# EAGLE design sx1509-breakout_mount_remap2 (EAGLE 9.1.3)
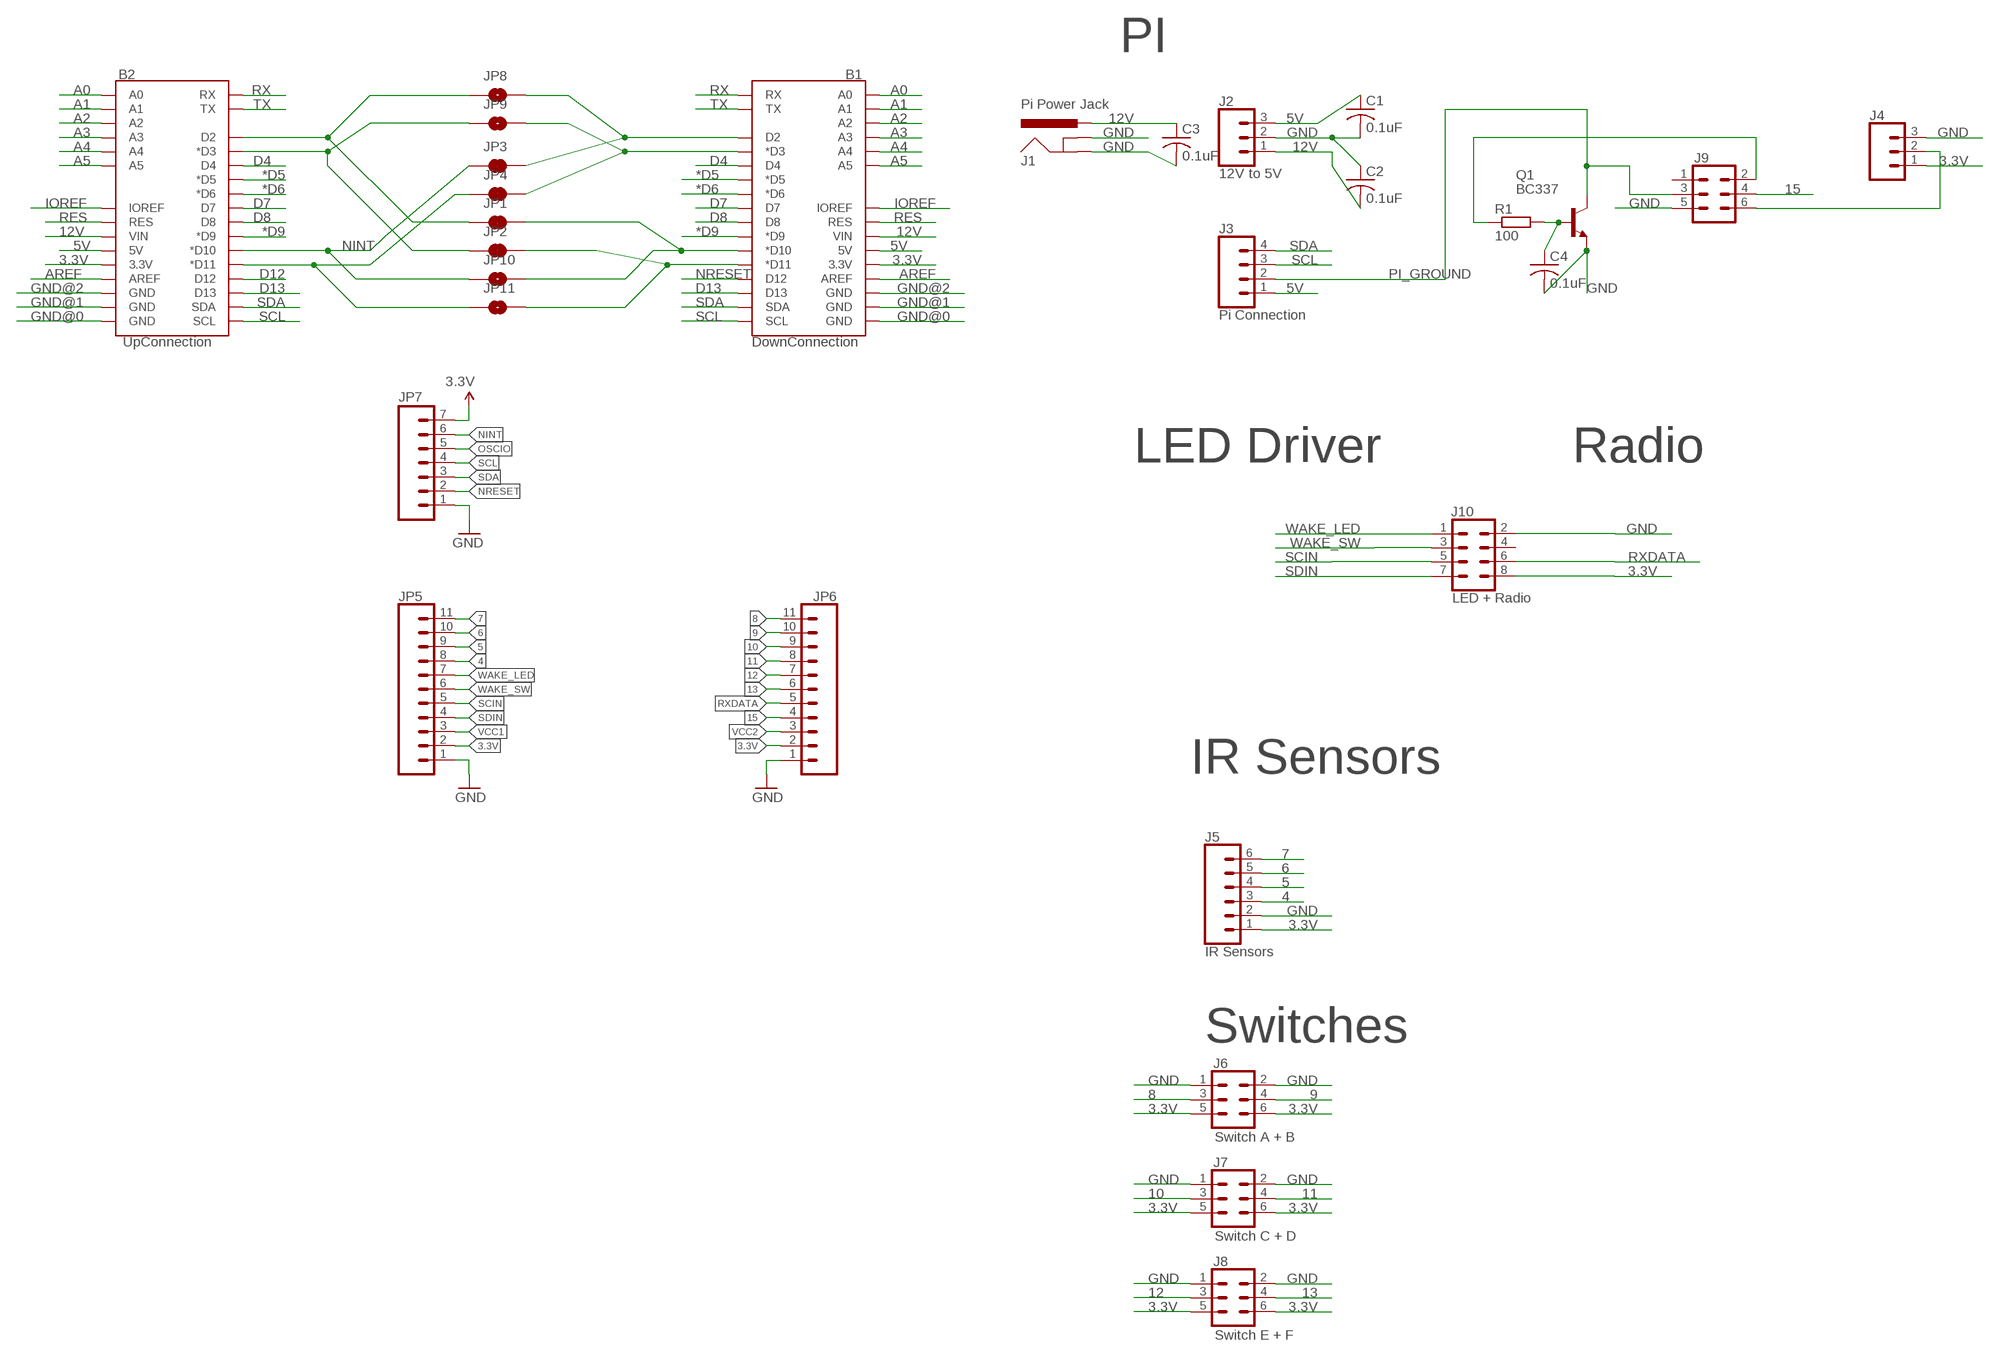
[diagram p0: schematic, sheet 1]

## Parts
B1  DownConnection  ARDUINO_UNO_R3_SHIELDNOLABELS  [UNO_R3_SHIELD_NOLABELS]
B2  UpConnection  ARDUINO_UNO_R3_SHIELDNOLABELS  [UNO_R3_SHIELD_NOLABELS]
C1  0.1uF  C-US025-024X044  [C025-024X044]
C2  0.1uF  C-US025-024X044  [C025-024X044]
C3  0.1uF  C-US025-024X044  [C025-024X044]
C4  0.1uF  C-US025-024X044  [C025-024X044]
J1  Pi Power Jack  POWER_JACKPTH_BREAD  [POWER_JACK_PTH_BREAD]
J2  12V to 5V  CONN_03  [1X03]
J3  Pi Connection  CONN_04  [1X04]
J4  CONN_03  [1X03]
J5  IR Sensors  CONN_06SILK_FEMALE_PTH  [1X06]
J6  Switch A + B  CONN_03X2FEMALE  [2X3]
J7  Switch C + D  CONN_03X2FEMALE  [2X3]
J8  Switch E + F  CONN_03X2FEMALE  [2X3]
J9  CONN_03X2NO_SILK  [2X3-NS]
J10  LED + Radio  CONN_04X2  [2X4]
JP1  JUMPER-SMT_2_NC_TRACE_NO-SILK  [SMT-JUMPER_2_NC_TRACE_NO-SILK]
JP2  JUMPER-SMT_2_NC_TRACE_NO-SILK  [SMT-JUMPER_2_NC_TRACE_NO-SILK]
JP3  JUMPER-SMT_2_NC_TRACE_NO-SILK  [SMT-JUMPER_2_NC_TRACE_NO-SILK]
JP4  JUMPER-SMT_2_NC_TRACE_NO-SILK  [SMT-JUMPER_2_NC_TRACE_NO-SILK]
JP5  CONN_11  [1X11]
JP6  CONN_11  [1X11]
JP7  M07  [1X07]
JP8  JUMPER-SMT_2_NO_NO-SILK  [SMT-JUMPER_2_NO_NO-SILK]
JP9  JUMPER-SMT_2_NO_NO-SILK  [SMT-JUMPER_2_NO_NO-SILK]
JP10  JUMPER-SMT_2_NO_NO-SILK  [SMT-JUMPER_2_NO_NO-SILK]
JP11  JUMPER-SMT_2_NO_NO-SILK  [SMT-JUMPER_2_NO_NO-SILK]
Q1  BC337  [TO92]
R1  100  R0204/7  [0204/7]

## Nets
3.3V: B1.3.3V B2.3.3V J4.1 J5.1 J6.5 J6.6 J7.5 J7.6 J8.5 J8.6 J10.8 JP5.2 JP6.2 JP7.7
4: J5.3 JP5.8
5: J5.4 JP5.9
5V: B1.5V B2.5V C1.1 J2.3 J3.1
6: J5.5 JP5.10
7: J5.6 JP5.11
8: J6.3 JP6.11
9: J6.4 JP6.10
10: J7.3 JP6.9
11: J7.4 JP6.8
12: J8.3 JP6.7
12V: B1.VIN B2.VIN C2.2 C3.1 J1.PWR J2.1
13: J8.4 JP6.6
15: J9.4 JP6.4
*D5: B1.D5(*D5) B2.D5(*D5)
*D6: B1.D6(*D6) B2.D6(*D6)
*D9: B1.D9(*D9) B2.D9(*D9)
A0: B1.A0 B2.A0
A1: B1.A1 B2.A1
A2: B1.A2 B2.A2
A3: B1.A3 B2.A3
A4: B1.A4 B2.A4
A5: B1.A5 B2.A5
AREF: B1.AREF B2.AREF
D4: B1.D4 B2.D4
D7: B1.D7 B2.D7
D8: B1.D8 B2.D8
D12: B2.D12
D13: B1.D13 B2.D13
GND: C1.2 C2.1 C3.2 C4.2 J1.GND J1.GNDBREAK J2.2 J4.3 J5.2 J6.1 J6.2 J7.1 J7.2 J8.1 J8.2 J9.5 J10.2 JP5.1 JP6.1 JP7.1 Q1.1(E)
GND@0: B1.GND@0(GND) B2.GND@0(GND)
GND@1: B1.GND@1(GND) B2.GND@1(GND)
GND@2: B1.GND@2(GND) B2.GND@2(GND)
IOREF: B1.IOREF B2.IOREF
N$2: C4.1 Q1.2(B) R1.2
N$3: J4.2 J9.6
N$4: J9.2 R1.1
N$5: B1.D2 JP3.2 JP8.2
N$6: B1.D3(*D3) JP4.2 JP9.2
N$7: B1.D10(*D10) JP1.2 JP10.2
N$8: B1.D11(*D11) JP2.2 JP11.2
N$9: B2.D2 JP1.1 JP8.1
N$10: B2.D3(*D3) JP2.1 JP9.1
N$12: B2.D11(*D11) JP4.1 JP11.1
NINT: B2.D10(*D10) JP3.1 JP7.6 JP10.1
NRESET: B1.D12 JP7.2
OSCIO: JP7.5
PI_GROUND: J3.2 J9.3 Q1.3(C)
RES: B1.RES B2.RES
RX: B1.RX B2.RX
RXDATA: J10.6 JP6.5
SCIN: J10.5 JP5.5
SCL: B1.SCL B2.SCL J3.3 JP7.4
SDA: B1.SDA B2.SDA J3.4 JP7.3
SDIN: J10.7 JP5.4
TX: B1.TX B2.TX
VCC1: JP5.3
VCC2: JP6.3
WAKE_LED: J10.1 JP5.7
WAKE_SW: J10.3 JP5.6
Unconnected: J9.1 J10.4

## Notes on the sheet
- PI
- LED Driver | Radio
- IR Sensors
- Switches

## Library data of the parts
B1 B2 = keir_library:ARDUINO_UNO_R3_SHIELD: Arduino R3 Shield Footprint Shield form compatible with the Arduino Uno R3. SparkFun Products: MG2639 Cellular Shield <https://www.sparkfun.com/products/13120> MIDI Shield <https://www.sparkfun.com/products/12898> R3 Stackable Headers Kit <https://www.sparkfun.com/products/11417>
C1-C4 = adafruit:C-US: CAPACITOR, American symbol
J1 = SparkFun-Connectors:POWER_JACK: Power Jack Connector This is the standard 5.5mm barrel jack for power. The PTH is the most common, proven, reliable, footprint. The Slot footprint only works if the mill layer is transmitted to the PCB fab house so be warned. Here are the connectors we sell at SparkFun: DC Barrel Power Jack/Connector <https://www.sparkfun.com/products/119> (PRT-00119) DC Barrel Power Jack/Connector (SMD) <https://www.sparkfun.com/products/12748> (PRT-12748) DC Barrel Jack Adapter - Breadboard Compatible <https://www.sparkfun.com/products/10811> (PRT-10811) It is used on this SparkFun product (and many, many others): SparkFun RedBoard - Programmed with Arduino <https://www.sparkfun.com/products/12757> (DEV-12757) Also, if you need a mating power supply or connector, please check these out: Wall Adapter Power Supply - 9VDC 650mA <https://www.sparkfun.com/products/298> (TOL-00298) DC Barrel Jack Adapter - Male <https://www.sparkfun.com/products/10287> (PRT-10287); PROD_ID: PRT-10811
J2 J4 = SparkFun-Connectors:CONN_03: Multi connection point. Often used as Generic Header-pin footprint for 0.1 inch spaced/style header connections On any of the 0.1 inch spaced packages, you can populate with these: Break Away Headers - Straight <https://www.sparkfun.com/products/116> (PRT-00116) Break Away Male Headers - Right Angle <https://www.sparkfun.com/products/553> (PRT-00553) Female Headers <https://www.sparkfun.com/products/115> (PRT-00115) Break Away Headers - Machine Pin <https://www.sparkfun.com/products/117> (PRT-00117) Break Away Female Headers - Swiss Machine Pin <https://www.sparkfun.com/products/743> (PRT-00743) Stackable Header - 3 Pin (Female, 0.1") <https://www.sparkfun.com/products/13875> (PRT-13875) For SCREWTERMINALS and SPRING TERMINALS visit here: Screw Terimnals on SparkFun.com <https://www.sparkfun.com/search/results?term=Screw+Terminals> (5mm/3.5mm/2.54mm spacing) This device is also useful as a general connection point to wire up your design to another part of your project. Our various solder wires solder well into these plated through hole pads. Hook-Up Wire - Assortment (Stranded, 22 AWG) <https://www.sparkfun.com/products/11375> (PRT-11375) Hook-Up Wire - Assortment (Solid Core, 22 AWG) <https://www.sparkfun.com/products/11367> (PRT-11367) View the entire wire category on our website here <https://www.sparkfun.com/categories/141> Special notes: Molex polarized connector foot print use with SKU : PRT-08232 with associated crimp pins and housings.
J3 = SparkFun-Connectors:CONN_04: Multi connection point. Often used as Generic Header-pin footprint for 0.1 inch spaced/style header connections On any of the 0.1 inch spaced packages, you can populate with these: Break Away Headers - Straight <https://www.sparkfun.com/products/116> (PRT-00116) Break Away Male Headers - Right Angle <https://www.sparkfun.com/products/553> (PRT-00553) Female Headers <https://www.sparkfun.com/products/115> (PRT-00115) Break Away Headers - Machine Pin <https://www.sparkfun.com/products/117> (PRT-00117) Break Away Female Headers - Swiss Machine Pin <https://www.sparkfun.com/products/743> (PRT-00743) For SCREWTERMINALS and SPRING TERMINALS visit here: Screw Terimnals on SparkFun.com <https://www.sparkfun.com/search/results?term=Screw+Terminals> (5mm/3.5mm/2.54mm spacing) This device is also useful as a general connection point to wire up your design to another part of your project. Our various solder wires solder well into these plated through hole pads. Hook-Up Wire - Assortment (Stranded, 22 AWG) <https://www.sparkfun.com/products/11375> (PRT-11375) Hook-Up Wire - Assortment (Solid Core, 22 AWG) <https://www.sparkfun.com/products/11367> (PRT-11367) View the entire wire category on our website here <https://www.sparkfun.com/categories/141> Special notes: Molex polarized connector foot print use with SKU : PRT-08231 with associated crimp pins and housings. 1MM SMD Version SKU: PRT-10208; PROD_ID: CONN-09696
J5 = SparkFun-Connectors:CONN_06: Multi connection point. Often used as Generic Header-pin footprint for 0.1 inch spaced/style header connections On any of the 0.1 inch spaced packages, you can populate with these: Break Away Headers - Straight <https://www.sparkfun.com/products/116> (PRT-00116) Break Away Male Headers - Right Angle <https://www.sparkfun.com/products/553> (PRT-00553) Female Headers <https://www.sparkfun.com/products/115> (PRT-00115) Break Away Headers - Machine Pin <https://www.sparkfun.com/products/117> (PRT-00117) Break Away Female Headers - Swiss Machine Pin <https://www.sparkfun.com/products/743> (PRT-00743) Arduino Stackable Header - 6 Pin <https://www.sparkfun.com/products/9280> (PRT-09280) For SCREWTERMINALS and SPRING TERMINALS visit here: Screw Terimnals on SparkFun.com <https://www.sparkfun.com/search/results?term=Screw+Terminals> (5mm/3.5mm/2.54mm spacing) This device is also useful as a general connection point to wire up your design to another part of your project. Our various solder wires solder well into these plated through hole pads. Hook-Up Wire - Assortment (Stranded, 22 AWG) <https://www.sparkfun.com/products/11375> (PRT-11375) Hook-Up Wire - Assortment (Solid Core, 22 AWG) <https://www.sparkfun.com/products/11367> (PRT-11367) View the entire wire category on our website here <https://www.sparkfun.com/categories/141>; PROD_ID: CONN-08437
J6-J8 = SparkFun-Connectors:CONN_03X2: Multi connection point. Often used as Generic Header-pin footprint for 0.1 inch spaced/style header connections You can populate with any combo of single row headers, but if you'd like an exact match, check these: Header - 2x3 (Male, 0.1") <https://www.sparkfun.com/products/12807> (PRT-12807) Header - 2x3 (Female, 0.1") <https://www.sparkfun.com/products/13010> (PRT-13010) 2x3 Pin Shrouded Header <https://www.sparkfun.com/products/10877> (PRT-10877) On any of the 0.1 inch spaced packages, you can populate with these: Break Away Headers - Straight <https://www.sparkfun.com/products/116> (PRT-00116) Break Away Male Headers - Right Angle <https://www.sparkfun.com/products/553> (PRT-00553) Female Headers <https://www.sparkfun.com/products/115> (PRT-00115) Break Away Headers - Machine Pin <https://www.sparkfun.com/products/117> (PRT-00117) Break Away Female Headers - Swiss Machine Pin <https://www.sparkfun.com/products/743> (PRT-00743) Special note: the shrouded connector mates well with our 3x2 ribbon cables: Ribbon Crimp Connector - 6-pin (2x3, Female) <https://www.sparkfun.com/products/10651> (PRT-10651) Ribbon Cable - 6 wire (15ft) <https://www.sparkfun.com/products/10646> (PRT-10646); PROD_ID: CONN-11566; VALUE: FEMALE 2x3
J9 = SparkFun-Connectors:CONN_03X2: Multi connection point. Often used as Generic Header-pin footprint for 0.1 inch spaced/style header connections You can populate with any combo of single row headers, but if you'd like an exact match, check these: Header - 2x3 (Male, 0.1") <https://www.sparkfun.com/products/12807> (PRT-12807) Header - 2x3 (Female, 0.1") <https://www.sparkfun.com/products/13010> (PRT-13010) 2x3 Pin Shrouded Header <https://www.sparkfun.com/products/10877> (PRT-10877) On any of the 0.1 inch spaced packages, you can populate with these: Break Away Headers - Straight <https://www.sparkfun.com/products/116> (PRT-00116) Break Away Male Headers - Right Angle <https://www.sparkfun.com/products/553> (PRT-00553) Female Headers <https://www.sparkfun.com/products/115> (PRT-00115) Break Away Headers - Machine Pin <https://www.sparkfun.com/products/117> (PRT-00117) Break Away Female Headers - Swiss Machine Pin <https://www.sparkfun.com/products/743> (PRT-00743) Special note: the shrouded connector mates well with our 3x2 ribbon cables: Ribbon Crimp Connector - 6-pin (2x3, Female) <https://www.sparkfun.com/products/10651> (PRT-10651) Ribbon Cable - 6 wire (15ft) <https://www.sparkfun.com/products/10646> (PRT-10646)
J10 = SparkFun-Connectors:CONN_04X2: Multi connection point. Often used as Generic Header-pin footprint for 0.1 inch spaced/style header connections On any of the 0.1 inch spaced packages, you can populate with these: Break Away Headers - Straight <https://www.sparkfun.com/products/116> (PRT-00116) Break Away Male Headers - Right Angle <https://www.sparkfun.com/products/553> (PRT-00553) Female Headers <https://www.sparkfun.com/products/115> (PRT-00115) Break Away Headers - Machine Pin <https://www.sparkfun.com/products/117> (PRT-00117) Break Away Female Headers - Swiss Machine Pin <https://www.sparkfun.com/products/743> (PRT-00743)
JP1-JP4 = SparkFun-Jumpers:JUMPER-SMT_2_NC_TRACE: Normally closed trace jumper This jumper has a trace between two pads so it's normally closed (NC). Use a razor knife to open the connection. For best results follow the IPC guidelines for cutting traces: Cutout at least 0.063 mm (0.005 in). Remove all loose material to clean up the cut area. Seal the cut with an approved epoxy. Reapply solder to reclose the connection.
JP5 JP6 = SparkFun-Connectors:CONN_11: Multi connection point. Often used as Generic Header-pin footprint for 0.1 inch spaced/style header connections On any of the 0.1 inch spaced packages, you can populate with these: Break Away Headers - Straight <https://www.sparkfun.com/products/116> (PRT-00116) Break Away Male Headers - Right Angle <https://www.sparkfun.com/products/553> (PRT-00553) Female Headers <https://www.sparkfun.com/products/115> (PRT-00115) Break Away Headers - Machine Pin <https://www.sparkfun.com/products/117> (PRT-00117) Break Away Female Headers - Swiss Machine Pin <https://www.sparkfun.com/products/743> (PRT-00743) For SCREWTERMINALS and SPRING TERMINALS visit here: Screw Terimnals on SparkFun.com <https://www.sparkfun.com/search/results?term=Screw+Terminals> (5mm/3.5mm/2.54mm spacing) This device is also useful as a general connection point to wire up your design to another part of your project. Our various solder wires solder well into these plated through hole pads. Hook-Up Wire - Assortment (Stranded, 22 AWG) <https://www.sparkfun.com/products/11375> (PRT-11375) Hook-Up Wire - Assortment (Solid Core, 22 AWG) <https://www.sparkfun.com/products/11367> (PRT-11367) View the entire wire category on our website here <https://www.sparkfun.com/categories/141>
JP7 = SparkFun-Connectors:M07: Header 7 Standard 7-pin 0.1" header. Use with straight break away headers (SKU : PRT-00116), right angle break away headers (PRT-00553), swiss pins (PRT-00743), machine pins (PRT-00117), and female headers (PRT-00115). NOTES ON THE VARIANTS LOCK and LOCK_LONGPADS... This footprint was designed to help hold the alignment of a through-hole component (i.e. 7-pin header) while soldering it into place. You may notice that each hole has been shifted either up or down by 0.005 of an inch from it's more standard position (which is usually a perfectly straight line). This slight alteration caused the pins (the squares in the middle) to touch the edges of the holes. Because they are alternating, it causes a "brace" to hold the header in place. 0.005 has proven to be the perfect amount of "off-center" position when using our standard breakaway headers. Although looks a little odd when you look at the bare footprint, once you have a header in there, the alteration is very hard to notice. Also, if you push a header all the way into place, it is covered up entirely on the bottom side. This idea of altering the position of holes to aid alignment will be further integrated into the Sparkfun Library for other footprints. It can help hold any component with 3 or more connection pins.
JP8-JP11 = SparkFun-Jumpers:JUMPER-SMT_2_NO: Normally open jumper This jumper has two pads in close proximity to each other. Apply solder to close the connection. Round pads are easier to solder for beginners, but are a lot larger. SparkFun Product that uses the round pads: SparkFun EL Sequencer <https://www.sparkfun.com/products/12781>
Q1 = transistor-npn:BC337*: NPN Transistor
R1 = eagle-ltspice:R: RESISTOR, European symbol; SPICEMODEL: NONE; SPICEPREFIX: R

## Board
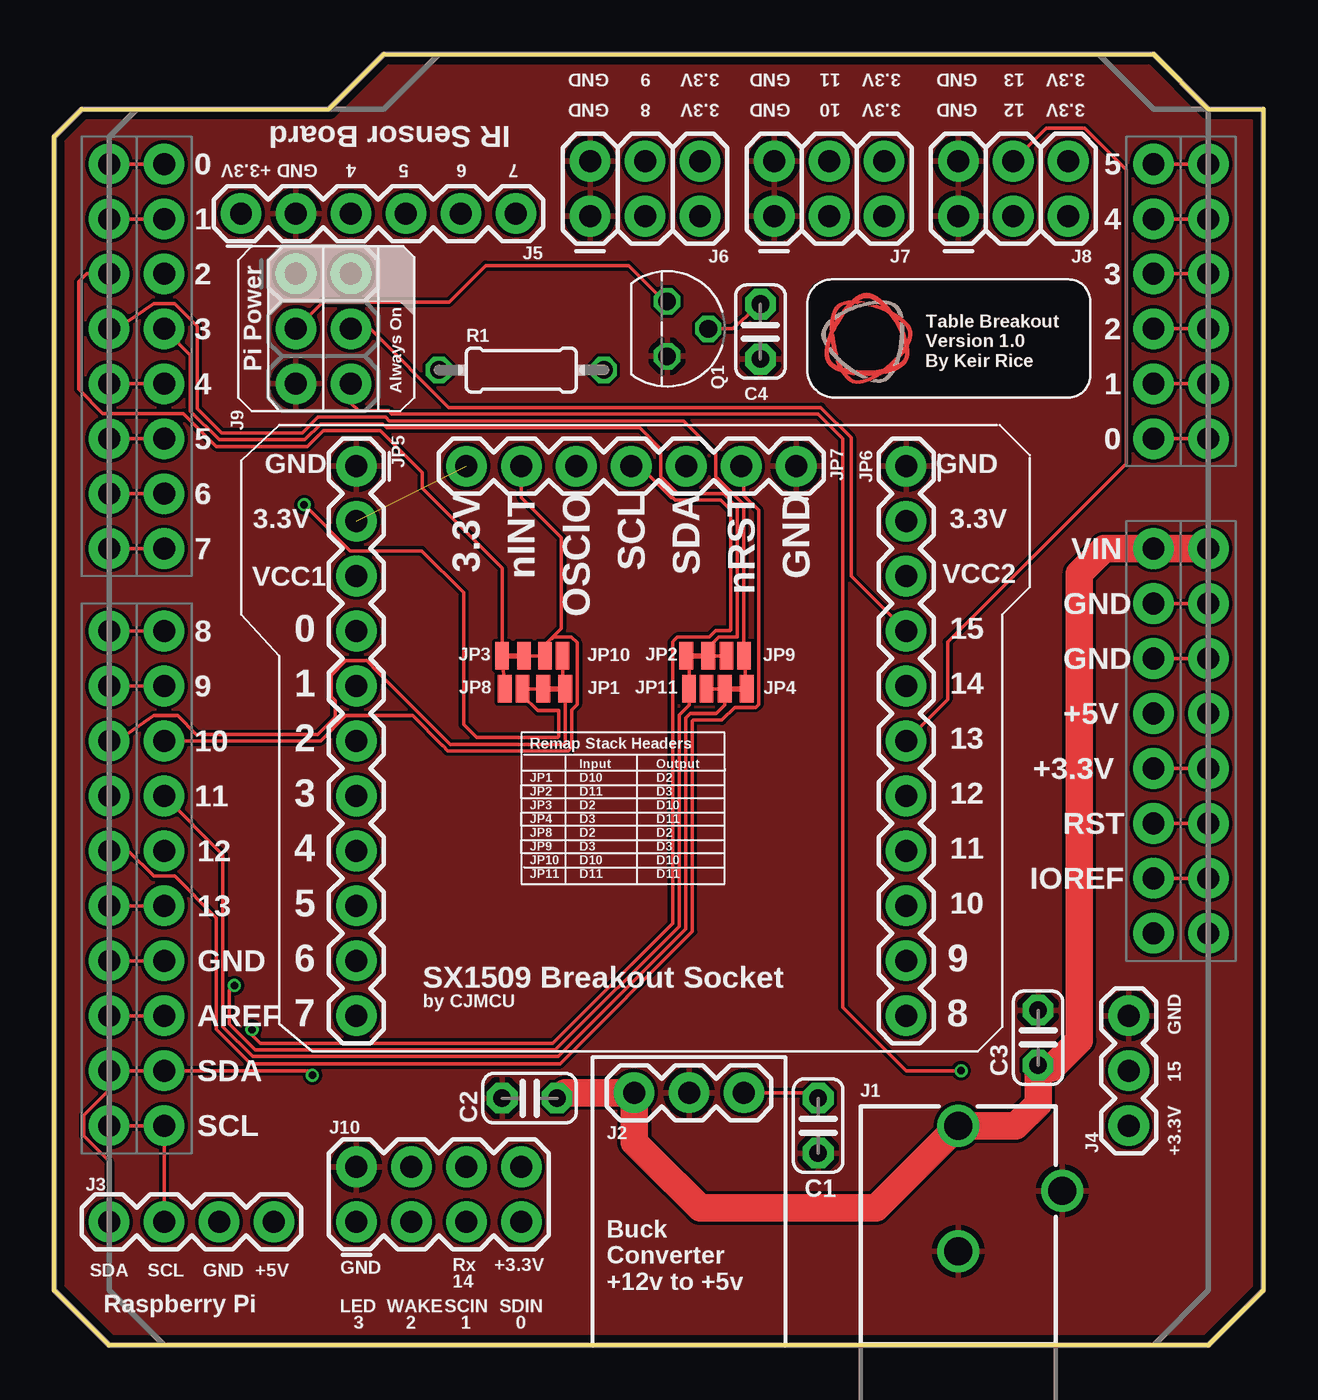
[diagram p1: board, top side]
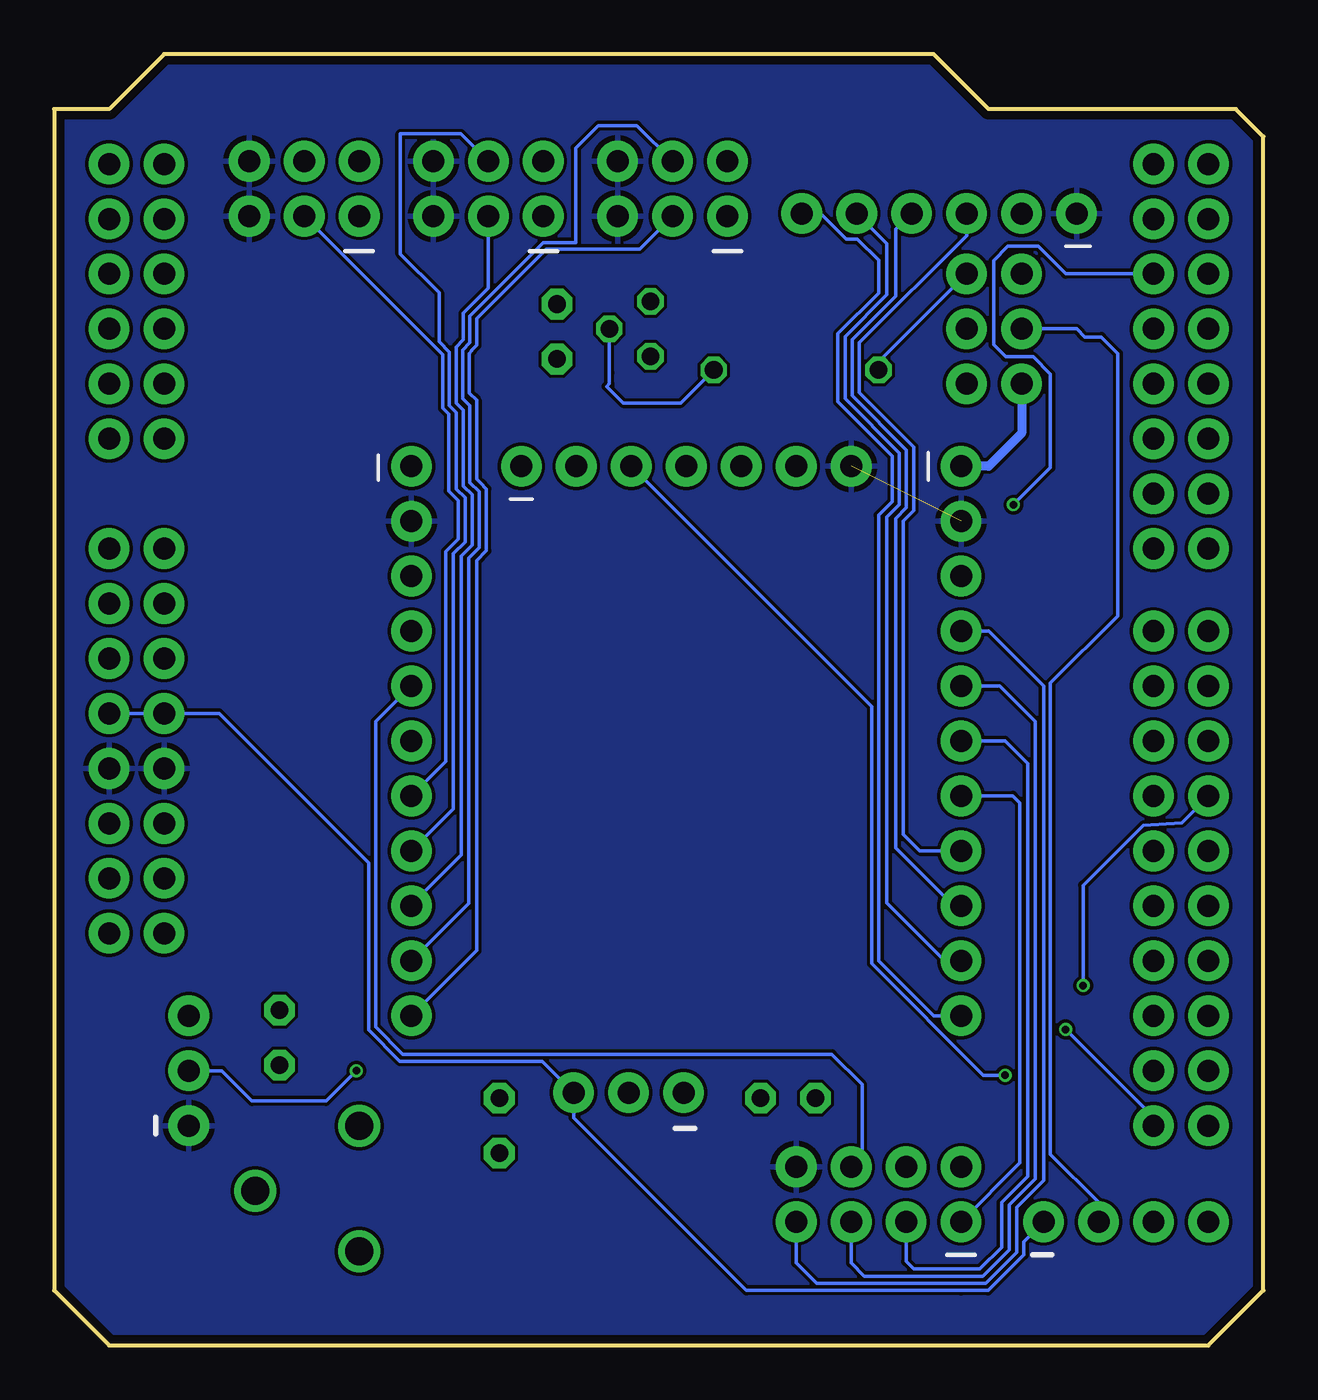
[diagram p2: board, bottom side, seen from below]

Size 55.88 x 59.69 mm. Coordinates in mm from the lower left corner, seen from the top.
Outline: 0,2.54 0,55.88 1.27,57.15 12.7,57.15 15.24,59.69 50.8,59.69 53.34,57.15 55.88,57.15 55.88,2.54 53.34,0 2.54,0 0,2.54
Copper layers (1*16): Top 0.035559375mm / dielectric 1.6mm / Bottom 0.035559375mm
Design rules "oshpark-2layer": minimum track width 6mil, minimum drill 10mil, track to track 6mil, track to pad 6mil, pad to pad 6mil, via to via 6mil, smd to smd 6mil, copper to edge 15mil, drill to drill 6mil, minimum pad ring 5mil, minimum via ring 5mil, stop-mask expansion 2.5mil, vias tented up to drill 0mil, thermal gap 10mil

### Footprints (pad centres in the part's own frame; a part is rotated, then mirrored left to right if it is on the bottom)
UNO_R3_SHIELD_NOLABELS = drill 1.016 pad 1.88: 3.3V 24.13,-3.81; 5V 24.13,-1.27; A0 24.13,11.43; A1 24.13,13.97; A2 24.13,16.51; A3 24.13,19.05; A4 24.13,21.59; A5 24.13,24.13; AREF -24.13,-15.24; D2 -24.13,19.05; D3 -24.13,16.51; D4 -24.13,13.97; D5 -24.13,11.43; D6 -24.13,8.89; D7 -24.13,6.35; D8 -24.13,2.54; D9 -24.13,0; D10 -24.13,-2.54; D11 -24.13,-5.08; D12 -24.13,-7.62; D13 -24.13,-10.16; GND@0 24.13,1.27; GND@1 24.13,3.81; GND@2 -24.13,-12.7; IOREF 24.13,-8.89; NC 24.13,-11.43; RES 24.13,-6.35; RX -24.13,24.13; SCL -24.13,-20.32; SDA -24.13,-17.78; TX -24.13,21.59; VIN 24.13,6.35
C025-024X044 = drill 0.813 pad 1.422 octagon: 1 -1.27,0; 2 1.27,0
POWER_JACK_PTH_BREAD = drill 1.3: GND 0,7.9; GNDBREAK 4.8,10.7; PWR 0,13.7
1X03 = drill 1.016 pad 1.88: 1 0,0; 2 2.54,0; 3 5.08,0
1X04 = drill 1.016 pad 1.88: 1 0,0; 2 2.54,0; 3 5.08,0; 4 7.62,0
1X06 = drill 1.016 pad 1.88: 1 0,0; 2 2.54,0; 3 5.08,0; 4 7.62,0; 5 10.16,0; 6 12.7,0
2X3 = drill 1.016 pad 1.88: 1 0,0; 2 0,2.54; 3 2.54,0; 4 2.54,2.54; 5 5.08,0; 6 5.08,2.54
2X3-NS = drill 1.016 pad 1.88: 1 -2.54,-1.27; 2 -2.54,1.27; 3 0,-1.27; 4 0,1.27; 5 2.54,-1.27; 6 2.54,1.27
2X4 = drill 1.016 pad 1.88: 1 -3.81,-1.27; 2 -3.81,1.27; 3 -1.27,-1.27; 4 -1.27,1.27; 5 1.27,-1.27; 6 1.27,1.27; 7 3.81,-1.27; 8 3.81,1.27
SMT-JUMPER_2_NC_TRACE_NO-SILK = smd 0.635 x 1.27: 1 -0.508,0; 2 0.508,0
1X11 = drill 1.016 pad 1.88: 1 0,0; 2 2.54,0; 3 5.08,0; 4 7.62,0; 5 10.16,0; 6 12.7,0; 7 15.24,0; 8 17.78,0; 9 20.32,0; 10 22.86,0; 11 25.4,0
1X07 = drill 1.016 pad 1.88: 1 0,0; 2 2.54,0; 3 5.08,0; 4 7.62,0; 5 10.16,0; 6 12.7,0; 7 15.24,0
SMT-JUMPER_2_NO_NO-SILK = smd 0.635 x 1.27: 1 -0.406,0; 2 0.406,0
TO92 = drill 0.813 octagon: 1 1.27,0; 2 0,1.905; 3 -1.27,0
0204/7 = drill 0.813 octagon: 1 -3.81,0; 2 3.81,0

### Placement (x,y rotation side)
B1  26.67,30.48 0 top
B2  29.21,30.48 0 top
C1  35.31,10.16 270 top
C2  21.97,11.43 0 top
C3  45.47,14.22 90 top
C4  32.64,46.86 270 top
J1  41.78,-3.56 0 top
J2  26.8,11.68 0 top
J3  10.16,5.71 180 top
J4  49.66,10.16 90 top
J5  8.64,52.32 0 top
J6  24.77,52.2 0 top
J7  33.27,52.2 0 top
J8  41.78,52.2 0 top
J9  12.45,46.99 270 top
J10  17.78,6.99 0 top
JP1  23.11,30.35 0 top
JP2  29.72,31.88 180 top
JP3  21.21,31.88 180 top
JP4  31.5,30.35 0 top
JP5  13.97,40.64 270 top
JP6  39.37,40.64 270 top
JP7  34.29,40.64 180 top
JP8  21.23,30.35 180 top
JP9  31.47,31.88 0 top
JP10  23.09,31.88 0 top
JP11  29.74,30.35 180 top
Q1  28.32,46.99 270 top
R1  21.59,45.09 0 top
U$1  [TRI_LOGO_5MM]  37.59,46.48 0 top

### Tracks (layer width: path | path; a pad name or v marks a point on that pad's centre or on a via)
3.3V  (1 unrouted)
  Top 0.152: B1.3.3V B2.3.3V
  pour Bottom: 0,55.88 1.27,57.15 12.7,57.15 15.24,59.69 50.8,59.69 53.34,57.15 55.88,57.15 55.88,2.54 53.34,0 2.54,0 0,2.54
4
  Bottom 0.152: JP5.8 15.88,22.86 16.64,23.62 16.64,38.11 16.17,38.58 16.17,41.53 18.67,44.03 18.67,46.35 13.72,51.31 J5.3
5
  Bottom 0.152: JP5.9 14.31,20.32 16.99,23 16.99,38.23 16.5,38.72 16.5,41.39 19,43.89 19,46.49 16.99,48.5 16.99,51.59 J5.4
5V
  Top 0.152: C1.1 35.18,11.68 J2.3
  Bottom 0.152: B2.5V B1.5V 48.26,29.21 41.35,22.3 41.35,19.05 41.35,14.58 39.91,13.13 33.33,13.13 J2.3 31.88,10.52 23.89,2.54 13.97,2.54 12.72,2.54 11.07,4.18 11.07,4.8 J3.1
6
  Bottom 0.152: J5.5 17.4,50.93 17.4,48.56 19.33,46.63 19.33,43.76 16.83,41.26 16.83,38.86 17.4,38.29 17.4,20.45 14.73,17.78 JP5.10
7
  Bottom 0.152: JP5.11 15.24,15.24 17.78,17.78 17.78,38.37 17.16,38.99 17.16,41.12 19.66,43.62 19.66,46.77 17.78,48.65 17.78,50.16 18.76,51.14 19.29,51.14 20.47,52.32 J5.6
8
  Bottom 0.152: JP6.11 36.36,18.25 36.36,36.27 35.9,36.73 35.9,39.59 36.19,39.88 | 36.19,39.88 36.36,40.05 36.36,43.69 36.7,44.03 36.7,45.85 36.57,45.97 36.57,46.02 36.36,46.23 36.36,47.46 33.15,50.67 28.83,50.67 J6.3 | 36.19,39.88
9
  Bottom 0.152: JP6.10 36.72,20.43 36.72,36.39 36.23,36.87 36.23,39.46 36.66,39.89 36.66,43.43 37,43.77 37,46.02 36.66,46.36 36.66,47.59 33.27,50.98 31.78,50.98 31.78,55.34 30.73,56.39 28.96,56.39 J6.4
10
  Bottom 0.152: JP6.9 39.37,20.37 37.07,22.67 37.07,36.5 36.56,37.01 36.56,39.32 36.97,39.73 36.97,43.23 37.31,43.57 37.31,46.14 36.97,46.48 36.97,47.71 35.81,48.87 35.81,49.53 J7.3
11
  Bottom 0.152: JP6.8 37.43,24.8 37.43,36.61 36.89,37.14 36.89,39.18 37.3,39.59 37.3,43.13 37.61,43.44 37.61,45.92 38.09,46.39 38.09,48.66 39.88,50.45 39.88,56.01 37.08,56.01 J7.4
12
  Bottom 0.152: JP6.7 37.78,26.99 37.78,36.7 37.21,37.27 37.21,39.05 37.66,39.5 37.66,43.05 37.92,43.32 37.92,45.79 J8.3
12V
  Top 1.27: 27.5,8.7 26.8,9.4 J2.1 23.62,11.68 C2.2 | 27.5,8.7 29.84,6.35 37.99,6.35 J1.PWR 44.43,10.14 45.47,11.18 C3.1 46.1,12.83 47.37,14.1 47.37,35.69 48.51,36.83 B1.VIN B2.VIN | 27.5,8.7
13
  Top 0.152: JP6.6 41.29,29.86 41.29,32.52 49.53,40.77 49.53,54.36 47.62,56.26 45.85,56.26 J8.4
15
  Top 0.152: JP6.4 36.83,35.56 36.83,41.96 35.43,43.36 18.24,43.36 14.61,46.99 J9.4
*D5
  Top 0.152: B1.D5 B2.D5
*D6
  Top 0.152: B1.D6 B2.D6
*D9
  Top 0.152: B1.D9 B2.D9
A0
  Top 0.152: B2.A0 B1.A0
A1
  Top 0.152: B1.A1 B2.A1
A2
  Top 0.152: B2.A2 B1.A2
A3
  Top 0.152: B1.A3 B2.A3
A4
  Top 0.152: B2.A4 B1.A4
A5
  Top 0.152: B1.A5 B2.A5
AREF
  Top 0.152: B1.AREF B2.AREF
D4
  Top 0.152: B1.D4 B2.D4
D7
  Top 0.152: B1.D7 B2.D7
D8
  Top 0.152: B1.D8 B2.D8
D13
  Top 0.152: B1.D13 B2.D13
GND
  Bottom 0.406: J9.5 11.18,42.16 12.7,40.64 JP5.1
  pour Top: 0,55.88 1.27,57.15 12.7,57.15 15.24,59.69 50.8,59.69 53.34,57.15 55.88,57.15 55.88,2.54 53.34,0 2.54,0 0,2.54
GND@0
  Top 0.152: B2.GND@0 B1.GND@0
GND@1
  Top 0.152: B1.GND@1 B2.GND@1
GND@2
  Top 0.152: B1.GND@2 B2.GND@2
IOREF
  Top 0.152: B1.IOREF B2.IOREF
N$1
  cutout Top: 34.8,46.61 34.8,45.09 arc90 36.07,43.81 46.86,43.81 arc90 47.88,44.83 47.88,48.26 arc90 46.86,49.28 35.81,49.28 arc90 34.8,48.26
N$2
  Top 0.152: Q1.2 31.37,46.99 C4.1
  Bottom 0.152: R1.2 26.92,43.56 29.59,43.56 30.35,44.32 30.23,44.45 30.23,44.96 | 30.23,44.96 Q1.2 | 30.23,44.96
N$3  (via drill 0.35)
  Top 0.152: v41.91,12.7 39.37,12.7 36.45,15.62 36.45,41.91 35.31,43.05 15.61,43.05 15.46,43.2 14.07,43.2 13.72,43.56 J9.6
  Bottom 0.152: v41.91,12.7 43.31,11.3 46.74,11.3 48.13,12.7 J4.2
N$4
  Bottom 0.152: J9.2 17.78,45.47 R1.1
N$5
  Top 0.152: JP8.2 JP3.2 20.7,35.94 17.02,39.62 17.02,40.34 15.06,42.29 12.45,42.29 11.71,41.55 7.49,41.55 5.97,43.08 2.26,43.08 1.14,44.2 1.14,49.16 1.51,49.53 B1.D2
N$6
  Top 0.152: JP4.2 JP9.2 31.88,38.86 30.58,40.16 30.58,41.24 29.08,42.74 15.49,42.74 15.33,42.9 12.19,42.9 11.46,42.16 7.75,42.16 6.6,43.31 6.61,43.31 6.61,47.12 5.56,48.16 4.6,48.16 2.92,46.99 B1.D3
N$7
  Top 0.152: JP10.2 23.5,30.48 JP1.2 23.62,27.79 18.32,27.79 14.99,31.12 14.45,31.65 13.49,31.65 12.8,30.96 12.8,30 12.99,29.81 12.99,29.05 12.19,28.25 6.58,28.25 5.71,29.11 4.6,29.11 2.92,27.94 B1.D10
N$8  (via drill 0.35)
  Top 0.152: JP2.2 29.34,31.75 JP11.2 29.34,29.59 28.88,29.13 28.88,19.38 23.17,13.66 9.29,13.66 8.1,14.86 8.1,16.41 v8.33,16.64
  Bottom 0.152: B1.D11 3.78,24.16 5.56,24.03 8.33,21.26 v8.33,16.64
N$9  (via drill 0.35)
  Top 0.152: v11.56,38.86 13.69,36.73 16.99,36.73 18.92,34.8 18.92,28.7 19.53,28.09 23.27,28.09 23.32,28.14 23.32,29.34 22.35,29.34 21.64,30.05 JP8.1 JP1.1
  Bottom 0.152: v11.56,38.86 9.84,40.58 9.84,44.9 10.64,45.7 11.91,45.7 12.47,46.25 12.47,50.14 11.81,50.8 10.41,50.8 9.14,49.53 B2.D2
N$10
  Top 0.152: B2.D3 6.3,45.77 6.3,43.43 6.3,43.18 7.62,41.86 11.58,41.86 12.32,42.6 15.19,42.6 15.37,42.42 27.05,42.42 28.04,41.43 28.04,40.16 28.83,39.37 30.94,39.37 31.57,38.73 31.57,32.74 30.71,32.74 30.23,32.26 JP2.1 JP9.1
N$12
  Top 0.152: JP11.1 JP4.1 30.99,29.59 30.61,29.21 29.39,29.21 29.18,29.01 29.18,19.25 23.29,13.36 9.17,13.36 7.8,14.73 7.8,22.68 B2.D11
NINT
  Top 0.152: B2.D10 12.32,27.94 13.49,29.11 16.56,29.11 17.95,27.72 18.19,27.48 23.75,27.48 23.93,27.66 23.93,29.38 24.17,29.62 24.17,32.48 23.91,32.74 23.08,32.74 23.01,32.66 22.96,32.66 | JP7.6 21.59,39.19 23.44,37.34 23.44,33.15 22.96,32.66 | 22.96,32.66 22.68,32.38 JP10.1 JP3.1
NRESET
  Top 0.152: JP7.2 31.88,40.51 31.88,39.29 32.55,38.62 32.55,29.62 32.42,29.49 31.45,29.49 30.86,28.91 29.54,28.91 29.49,28.85 29.49,19.13 23.38,13.02 9.08,13.02 7.49,14.61 7.49,19.76 5.56,21.69 4.6,21.69 3.43,22.86 B1.D12
PI_GROUND
  Top 0.152: Q1.3 28.19,48.26 26.54,49.91 19.94,49.91 18.26,48.23 12.42,48.23 J9.3
  Bottom 0.152: J9.3 8.64,46.99 8.26,46.61 7.49,46.61 6.73,45.85 6.73,33.72 9.84,30.61 9.84,8.83 7.62,6.6 J3.2
RES
  Top 0.152: B2.RES B1.RES
RX
  Top 0.152: B1.RX B2.RX
RXDATA
  Bottom 0.152: JP6.5 41.02,28.83 41.02,27.18 41.02,14.71 39.77,13.46 19.94,13.46 18.54,12.06 18.54,8.76 J10.6
SCIN
  Bottom 0.152: J10.5 19.05,3.81 18.44,3.2 12.97,3.2 11.75,4.43 11.75,6.5 10.54,7.71 10.54,28.83 12.19,30.48 JP5.5
SCL  (via drill 0.35)
  Top 0.152: J3.3 B2.SCL B1.SCL | v9.14,14.61 9.02,14.48 9.53,13.97 23.04,13.97 28.57,19.5 28.57,32.51 28.66,32.6 28.66,32.61 28.8,32.74 30.28,32.74 30.58,33.05 31.24,33.05 31.27,33.07 31.27,38.61 30.81,39.06 28.7,39.06 28.59,39.18 28.51,39.18 27.05,40.64 JP7.4
  Bottom 0.152: v9.14,14.61 5.08,10.54 B2.SCL
SDA  (via drill 0.35)
  Top 0.152: v11.94,12.49 11.72,12.7 B2.SDA B1.SDA 3.43,12.7 1.37,10.64 1.37,9.68 2.54,8.51 J3.4
  Bottom 0.152: JP7.3 18.1,29.53 18.1,17.65 12.94,12.49 v11.94,12.49
SDIN
  Bottom 0.152: J10.7 21.59,3.81 20.65,2.87 12.84,2.87 11.39,4.32 11.39,6.39 10.16,7.62 10.16,30.48 12.7,33.02 JP5.4
TX
  Top 0.152: B1.TX B2.TX
WAKE_LED
  Bottom 0.152: JP5.7 11.58,25.4 11.25,25.07 11.25,8.43 J10.1
WAKE_SW
  Bottom 0.152: JP5.6 11.94,27.94 10.9,26.9 10.9,7.82 12.1,6.61 12.1,4.54 13.11,3.53 16.15,3.53 16.51,3.89 J10.3

### Text on the board
tNames: GND | 9 | 3.3V | GND | 11 | 3.3V | GND | 13 | 3.3V | GND | 8 | 3.3V | GND | 10 | 3.3V | GND | 12 | 3.3V | IR Sensor Board | +3.3V | GND | 4 | 5 | 6 | 7 | 0 | 5 | 1 | 4 | Pi Power | 2 | 3 | Always On | 3 | 2 | Table Breakout / Version 1.0 / By Keir Rice | 4 | 1 | 5 | GND | GND | 0 | 6 | 3.3V | nINT | OSCIO | SCL | SDA | nRST | GND | 3.3V | 3.3V | 7 | VCC1 | VCC2 | VIN | GND | 8 | 0 | 15 | 1 | 14 | GND | 9 | +5V | 2 | Remap Stack Headers | 13 | 10 | Input | Output | 3 | JP1 | D10 | D2 | 12 | +3.3V | 11 | JP2 | JP3 | D11 | D2 | D10 | D3 | JP4 | D3 | D11 | RST | 4 | JP8 | JP9 | D2 | D3 | D2 | D3 | 11 | 12 | JP10 | JP11 | D10 | D11 | D10 | D11 | IOREF | 13 | 5 | 10 | 6 | 9 | GND | SX1509 Breakout Socket | by CJMCU | AREF | 7 | 8 | GND | SDA | 15 | SCL | +3.3V | SDA | SCL | GND | +5V | GND | 14 | Rx | +3.3V | Buck / Converter / +12v to +5v | Raspberry Pi | LED | WAKE | SCIN | SDIN | 3 | 2 | 1 | 0